# EAGLE board PRN_S2_v1.0 (EAGLE 9.3.0), part 1 of 2
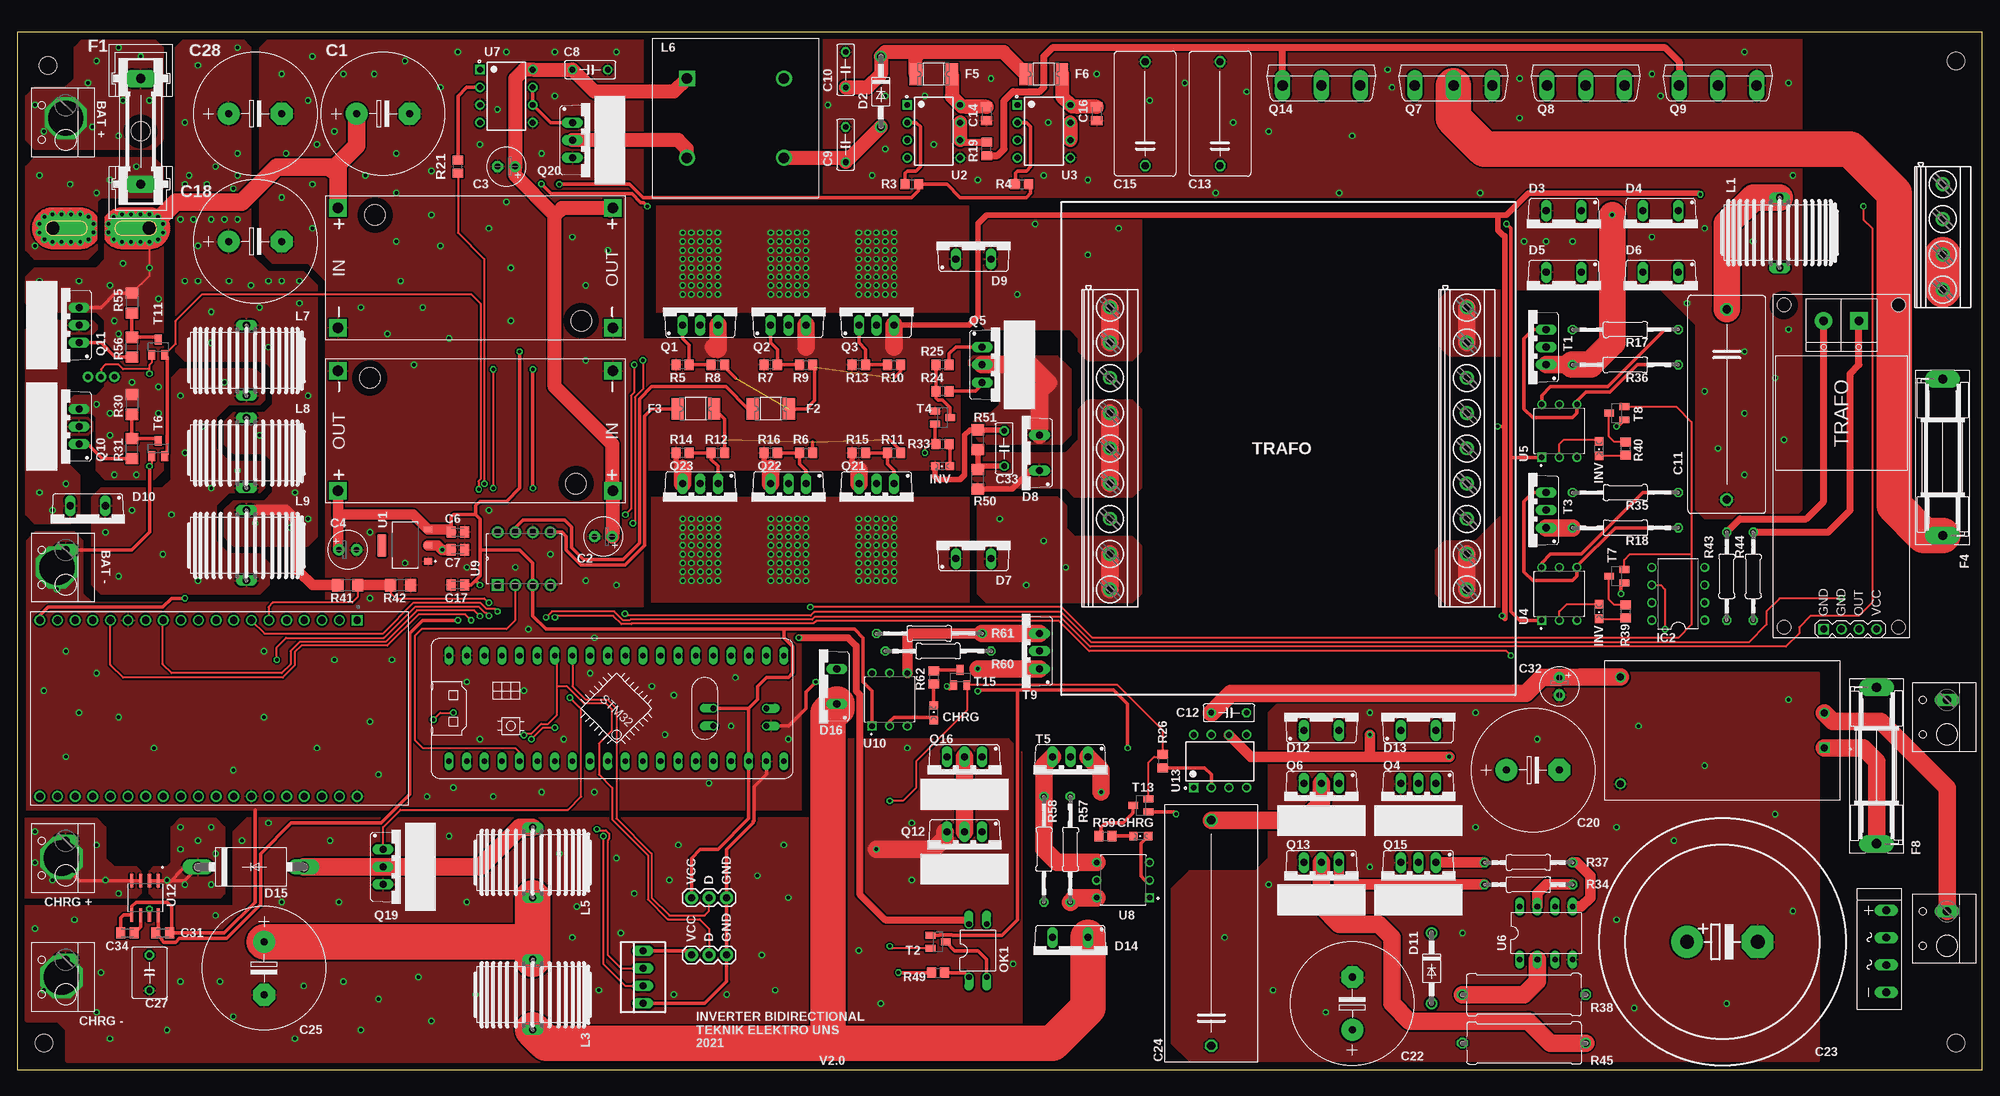
[diagram p2: board, top side]
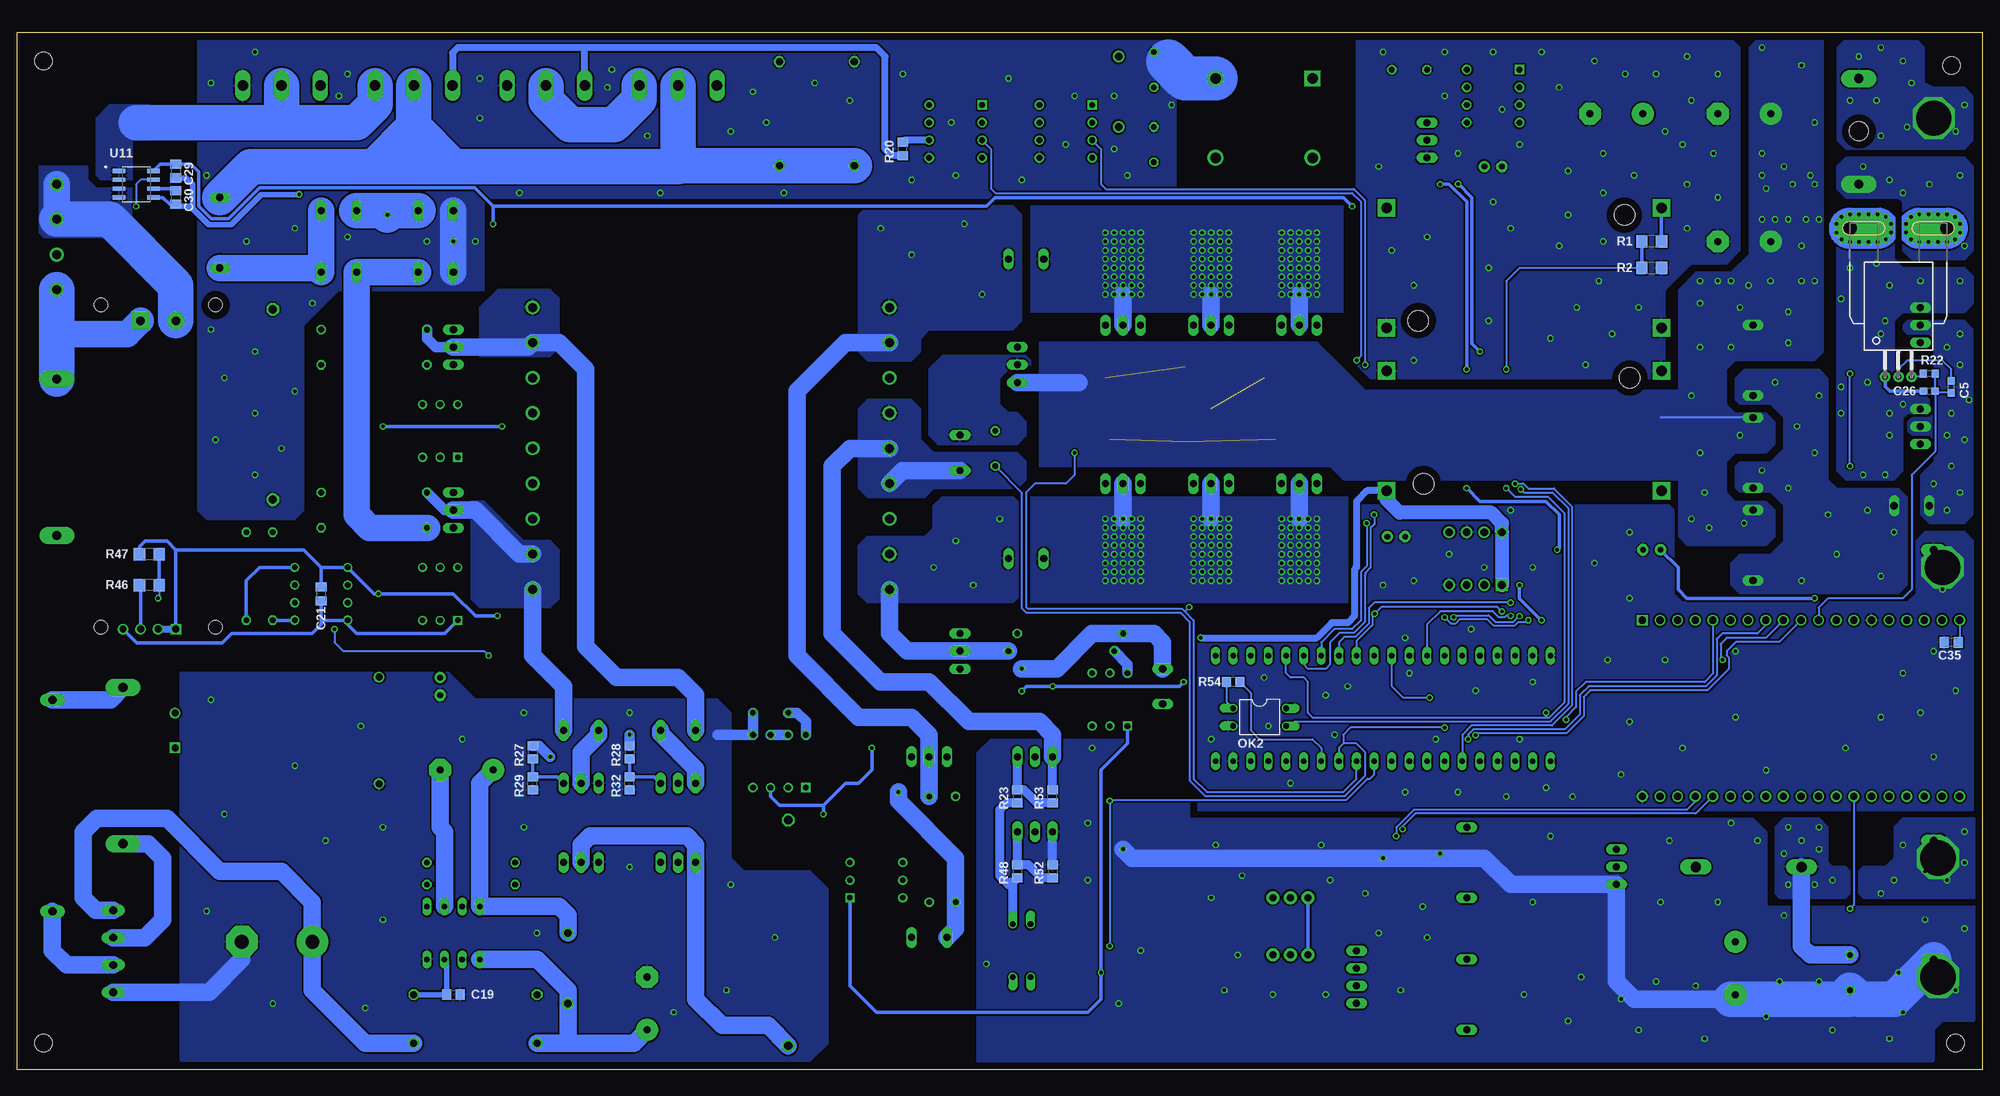
[diagram p3: board, bottom side, seen from below]

Size 283.19 x 149.53 mm. Coordinates in mm from the lower left corner, seen from the top.
Outline: 0,0 283.19,0 283.19,149.53 0,149.53 0,0
Copper layers (1*16): Top 0.035mm / dielectric 1.5mm / Bottom 0.035mm
Design rules "default *": minimum track width 10mil, minimum drill 0.5mm, track to track 10mil, track to pad 10mil, pad to pad 10mil, via to via 10mil, smd to smd 6mil, copper to edge 40mil, drill to drill 6mil, minimum pad ring 10mil, minimum via ring 8mil, stop-mask expansion 4mil, vias tented up to drill 0.6mm, thermal gap 10mil
Holes 2.54 mm at 4.45,144.78 279.4,145.41 279.4,3.81 3.81,3.81

## Footprints (pad centres in the part's own frame; a part is rotated, then mirrored left to right if it is on the bottom)
FBP1,5 = drill 1.118 long: + 5.811,-0.77; - -6,-0.77; AC1 1.874,-0.77; AC2 -2.063,-0.77
E7,5-18 = drill 1.016 pad 3.15: + -3.81,0 | drill 1.016 pad 3.15 octagon: - 3.81,0
E2,5-6 = drill 0.813 pad 1.6: + -1.27,0 | drill 0.813 pad 1.6 octagon: - 1.27,0
C0603 = smd 1.1 x 1: 1 -0.85,0; 2 0.85,0
C0805K = smd 1.3 x 1.6: 1 -1,0; 2 1,0
C050-025X075 = drill 0.813 octagon: 1 -2.54,0; 2 2.54,0
C275-113X316 = drill 1.194 octagon: 1 -13.716,0; 2 13.716,0
C150-091X182 = drill 1.016 octagon: 1 -7.493,0; 2 7.493,0
C0805 = smd 1.3 x 1.5: 1 -0.95,0; 2 0.95,0
EB35D = drill 2.007 pad 4.597: + -5.08,0 | drill 2.007 pad 4.597 octagon: - 5.08,0
C325-137X374 = drill 1.194 octagon: 1 -16.256,0; 2 16.256,0
C050-050X075 = drill 0.813 octagon: 1 -2.54,0; 2 2.54,0
DO41-10 = drill 1.118: A 5.08,0; C -5.08,0
TO220ACS = drill 1.016 long: A 2.54,-2.54; C -2.54,-2.54
DO201-15 = drill 1.499 long: A 7.62,0; C -7.62,0
W237-112 = drill 1.194 long: 1 2.5,-1.27
GSH15 = drill 1.321 pad 2.54 long: 1 -7.62,0; 2 7.62,0 | hole 2.794: 0,0
1812L = smd 1.78 x 3.15: 1 -2.62,0; 2 2.62,0
SH22,5 = drill 1.321 pad 2.54 long: 1 -11.252,0; 2 11.252,0
CB-PFF = drill 0.8 pad 1.5: 1 -1.91,-21.4; 2 0,-21.4; 3 1.91,-21.4 | drill 2 pad 4 offset: IP+ 7,0; IP- -7,0 | drill 0.5 pad 0.9: IP+@2 8.89,0.635; IP+@3 8.89,-0.635; IP+@4 8.175,-1.625; IP+@5 7,-2; IP+@6 5.675,-2; IP+@7 4.35,-2; IP+@8 3,-2; IP+@9 1.825,-1.625; IP+@10 1.1,-0.625; IP+@11 1.1,0.625; IP+@12 1.825,1.625; IP+@13 3,2; IP+@14 4.35,2; IP+@15 5.675,2; IP+@16 7,2; IP+@17 8.175,1.625; IP-@2 -8.89,0.635; IP-@3 -8.89,-0.635; IP-@4 -8.175,-1.625; IP-@5 -7,-2; IP-@6 -5.675,-2; IP-@7 -4.325,-2; IP-@8 -3,-2; IP-@9 -1.825,-1.625; IP-@10 -1.1,-0.625; IP-@11 -1.1,0.625; IP-@12 -1.825,1.625; IP-@13 -3,2; IP-@14 -4.325,2; IP-@15 -5.675,2; IP-@16 -7,2; IP-@17 -8.175,1.625
DIL08 = drill 0.813 pad 1.3: 1 -3.81,-3.81; 2 -1.27,-3.81; 3 1.27,-3.81; 4 3.81,-3.81; 5 3.81,3.81; 6 1.27,3.81; 7 -1.27,3.81; 8 -3.81,3.81
1X03 = drill 1.016 pad 1.88: 1 0,0; 2 2.54,0; 3 5.08,0
SFT830S = drill 1.016 long: 1 -5.08,0; 2 5.08,0
WE-AMT_750082107 = drill 1.52 square: 1 -6.985,5.715 | drill 1.52: 2 -6.985,-5.715; 3 6.985,-5.715; 4 6.985,5.715
CHIPLED_0805 = smd 1.2 x 1.2: A 0,-1.05; C 0,1.05
DIL04 = drill 0.813 offset: 1 -1.27,-3.81; 2 1.27,-3.81; 3 1.27,3.81; 4 -1.27,3.81
CONV_HLK-PM03 = drill 1 square: 1 -14.7,2.5 | drill 1: 2 -14.7,-2.5; 3 14.7,7.7; 4 14.7,-7.7
TO220BV = drill 1.016 long: D 0,-2.54; G -2.54,-2.54; S 2.54,-2.54
TO247BV = drill 1.499 long: D 0,-2.921; G -5.588,-2.921; S 5.588,-2.921
R1206 = smd 1.6 x 1.803: 1 -1.422,0; 2 1.422,0
R0805 = smd 1.3 x 1.5: 1 -0.95,0; 2 0.95,0
0207/15 = drill 0.813 octagon: 1 -7.62,0; 2 7.62,0
R0603 = smd 1 x 1.1: 1 -0.85,0; 2 0.85,0
0207/12 = drill 0.813 octagon: 1 -6.35,0; 2 6.35,0
0617/17 = drill 1.016 octagon: 1 -8.89,0; 2 8.89,0
TO220BV' = drill 1.016 long: G 2.54,-2.54; T1 -2.54,-2.54; T2 0,-2.54
SOT23-EBC = smd 1 x 1.4: B 0.95,-1.1; C 0,1.1; E -0.95,-1.1
SOT229P700X180-4N = smd 0.93 x 1.31: 1 -2.29,-3.345; 2 0,-3.345; 3 2.29,-3.345 | smd 3.24 x 1.31: 4 0,3.345
DIP762W50P254L977H451Q8 = drill 0.85 pad 1.35 square: 1 -3.81,3.81 | drill 0.85 pad 1.35: 2 -3.81,1.27; 3 -3.81,-1.27; 4 -3.81,-3.81; 5 3.81,-3.81; 6 3.81,-1.27; 7 3.81,1.27; 8 3.81,3.81
DIP762W50P254L730H500Q6 = drill 0.8 pad 1.2 square: 1 -3.81,2.54 | drill 0.8 pad 1.2: 2 -3.81,0; 3 -3.81,-2.54; 4 3.81,-2.54; 5 3.81,0; 6 3.81,2.54
DIL08' = drill 0.813 long: 1 -3.81,-3.81; 2 -1.27,-3.81; 3 1.27,-3.81; 4 3.81,-3.81; 5 3.81,3.81; 6 1.27,3.81; 7 -1.27,3.81; 8 -3.81,3.81
DIP254P762X533-8 = drill 1.118 square: 1 -7.62,7.62 | drill 1.118: 2 -7.62,5.08; 3 -7.62,2.54; 4 -7.62,0; 5 0,0; 6 0,2.54; 7 0,5.08; 8 0,7.62
SOIC127P600X175-8N = smd 1.97 x 0.6: 1 -2.475,1.905; 2 -2.475,0.635; 3 -2.475,-0.635; 4 -2.475,-1.905; 5 2.475,-1.905; 6 2.475,-0.635; 7 2.475,0.635; 8 2.475,1.905
MODULE_ESP32-DEVKITC-32D = drill 1.04 square: 1 -12.7,19.76 | drill 1.04: 2 -12.7,17.22; 3 -12.7,14.68; 4 -12.7,12.14; 5 -12.7,9.6; 6 -12.7,7.06; 7 -12.7,4.52; 8 -12.7,1.98; 9 -12.7,-0.56; 10 -12.7,-3.1; 11 -12.7,-5.64; 12 -12.7,-8.18; 13 -12.7,-10.72; 14 -12.7,-13.26; 15 -12.7,-15.8; 16 -12.7,-18.34; 17 -12.7,-20.88; 18 -12.7,-23.42; 19 -12.7,-25.96; 20 12.7,19.76; 21 12.7,17.22; 22 12.7,14.68; 23 12.7,12.14; 24 12.7,9.6; 25 12.7,7.06; 26 12.7,4.52; 27 12.7,1.98; 28 12.7,-0.56; 29 12.7,-3.1; 30 12.7,-5.64; 31 12.7,-8.18; 32 12.7,-10.72; 33 12.7,-13.26; 34 12.7,-15.8; 35 12.7,-18.34; 36 12.7,-20.88; 37 12.7,-23.42; 38 12.7,-25.96
DC-DC-STEP-DOWN-LM2596 = drill 1.5 pad 2.5 square: IN+ -19.812,8.636; IN- -19.812,-8.636; OUT+ 19.812,8.636; OUT- 19.812,-8.636 | hole 3: -14.478,7.62; 15.24,-7.62
BLUE_PILL = drill 0.8 long: P$1 -7.62,15.24; P$2 -7.62,12.7; P$3 -7.62,10.16; P$4 -7.62,7.62; P$5 -7.62,5.08; P$6 -7.62,2.54; P$7 -7.62,0; P$8 -7.62,-2.54; P$9 -7.62,-5.08; P$10 -7.62,-7.62; P$11 -7.62,-10.16; P$12 -7.62,-12.7; P$13 -7.62,-15.24; P$14 -7.62,-17.78; P$15 -7.62,-20.32; P$16 -7.62,-22.86; P$17 -7.62,-25.4; P$18 -7.62,-27.94; P$19 -7.62,-30.48; P$20 -7.62,-33.02; P$21 7.62,15.24; P$22 7.62,12.7; P$23 7.62,10.16; P$24 7.62,7.62; P$25 7.62,5.08; P$26 7.62,2.54; P$27 7.62,0; P$28 7.62,-2.54; P$29 7.62,-5.08; P$30 7.62,-7.62; P$31 7.62,-10.16; P$32 7.62,-12.7; P$33 7.62,-15.24; P$34 7.62,-17.78; P$35 7.62,-20.32; P$36 7.62,-22.86; P$37 7.62,-25.4; P$38 7.62,-27.94; P$39 7.62,-30.48; P$40 7.62,-33.02
AC-VOLTAGE-SENSOR#IC = drill 1 square: 1 23.495,-2.54 | drill 1: 2 23.495,0; 3 23.495,2.54; 4 23.495,5.08 | drill 1.2 pad 2.5 square: P1.1 -20.955,2.54 | drill 1.2 pad 2.5: P1.2 -20.955,-2.54 | hole 2: -23.241,8.255; -23.241,-8.255; 23.241,-8.255; 23.241,8.255
22-23-2041 = drill 1 long: 1 -3.81,0; 2 -1.27,0; 3 1.27,0; 4 3.81,0
MKDSN1,5/9-5,08 = drill 1.3 pad 2: 1 -20.341,0.025; 2 -15.261,0.025; 3 -10.181,0.025; 4 -5.101,0.025; 5 -0.021,0.025; 6 5.059,0.025; 7 10.139,0.025; 8 15.219,0.025; 9 20.299,0.025
MKDSN1,5/4-5,08 = drill 1.3 pad 2: 1 -7.641,0.025; 2 -2.561,0.025; 3 2.519,0.025; 4 7.599,0.025

## Placement (x,y rotation side)
B2  RECTIFIER-FBP1,5  [FBP1,5]  268.61,17.14 90 top
C1  680uF/100V  [E7,5-18]  52.7,137.8 0 top
C2  47uF/50V  [E2,5-6]  84.45,76.84 180 top
C3  47uF/50V  [E2,5-6]  70.48,130.18 180 top
C4  47uF/50V  [E2,5-6]  47.62,74.93 0 top
C5  [C0603]  4.45,98.42 90 bottom
C6  100nF  [C0805K]  63.5,77.47 0 top
C7  100nF  [C0805K]  63.5,74.93 0 top
C8  100nF  [C050-025X075]  82.55,144.14 0 top
C9  100nF  [C050-025X075]  119.38,133.35 90 top
C10  100nF  [C050-025X075]  119.38,144.14 90 top
C11  4.7uF  [C275-113X316]  246.38,95.89 270 top
C12  100nF  [C050-025X075]  174.62,51.44 0 top
C13  1.5uF  [C150-091X182]  173.35,137.8 90 top
C14  100nF  [C0805K]  139.7,137.8 270 top
C15  1.5uF  [C150-091X182]  162.56,137.8 90 top
C16  100nF  [C0805K]  155.57,137.8 270 top
C17  100nF  [C0805K]  63.5,69.85 180 top
C18  470uF/100V  [E7,5-18]  34.29,119.38 0 top
C19  300pf  [C0805]  220.34,10.79 0 bottom
C20  100uF/400V  [E7,5-18]  218.44,43.18 0 top
C21  100nF  [C0805K]  239.39,68.58 90 bottom
C22  100uF/400V  [E7,5-18]  192.41,9.52 90 top
C23  470uF/400V  [EB35D]  245.75,18.41 0 top
C24  [C325-137X374]  172.09,19.68 90 top
C25  47uF  [E7,5-18]  35.56,14.6 270 top
C26  [C0603]  7.62,97.79 0 bottom
C27  47uF  [C050-050X075]  19.05,13.97 270 top
C28  470uF/100V  [E7,5-18]  34.29,137.8 0 top
C29  100nF  [C0805K]  260.35,129.54 270 bottom
C30  1nF  [C0805K]  260.35,125.73 270 bottom
C31  100nF  [C0805K]  20.95,19.68 0 top
C32  47uF/50V  [E2,5-6]  222.25,55.24 270 top
C33  100nF  [C050-025X075]  142.24,89.53 90 top
C34  1nF  [C0805K]  15.87,19.68 180 top
C35  100nF  [C0805K]  4.45,61.59 180 bottom
D2  1N4007  [DO41-10]  124.46,140.97 270 top
D3  MUR860  [TO220ACS]  222.88,121.28 180 top
D4  MUR860  [TO220ACS]  236.85,121.28 180 top
D5  MUR860  [TO220ACS]  222.88,112.39 180 top
D6  MUR860  [TO220ACS]  236.85,112.39 180 top
D7  MUR810  [TO220ACS]  137.79,76.2 0 top
D8  MUR810  [TO220ACS]  144.78,88.9 90 top
D9  MUR810  [TO220ACS]  137.79,119.38 0 top
D10  MUR810  [TO220ACS]  10.16,78.74 180 top
D11  BA159  [DO41-10]  203.84,14.6 270 top
D12  MUR810  [TO220ACS]  187.96,51.44 0 top
D13  MUR810  [TO220ACS]  201.93,51.44 0 top
D14  MUR810  [TO220ACS]  151.76,16.51 180 top
D15  1N5400  [DO201-15]  33.66,29.21 0 top
D16  MUR810  [TO220ACS]  115.57,55.24 90 top
DC_PLN+  [W237-112]  5.71,30.48 90 top
DC_PLN-  [W237-112]  5.71,13.33 90 top
F1  50A  [GSH15]  17.78,135.25 270 top
F2  1812L010  [1812L]  108.58,95.25 180 top
F3  1812L010  [1812L]  97.79,95.25 180 top
F4  FUSESH22,5  [SH22,5]  277.5,88.27 90 top
F5  1812L010  [1812L]  132.08,143.51 180 top
F6  1812L010  [1812L]  147.95,143.51 180 top
F8  FUSE 0,5A  [SH22,5]  267.97,43.81 90 top
IC1  ACS758ECB-200B-PFF-T  [CB-PFF]  12.06,121.28 0 bottom
IC2  HCPL-3700  [DIL08]  239.39,68.58 90 top
J1  LM35  [1X03]  102.23,24.77 180 top
J2  LM35  [1X03]  102.23,16.51 180 top
L1  SFT830S  [SFT830S]  254,120.65 90 top
L3  SFT830S  [SFT830S]  74.29,10.79 90 top
L5  220uH  [SFT830S]  74.29,29.84 90 top
L6  [WE-AMT_750082107]  103.5,137.16 0 top
L7  4mH  [SFT830S]  33.02,102.23 90 top
L8  4mH  [SFT830S]  33.02,88.9 90 top
L9  4mH  [SFT830S]  33.02,75.56 90 top
LED3  [CHIPLED_0805]  133.35,87 90 top
LED5  [CHIPLED_0805]  227.97,66.04 180 top
LED6  [CHIPLED_0805]  227.97,89.53 180 top
LED9  [CHIPLED_0805]  161.92,33.66 90 top
LED10  [CHIPLED_0805]  132.08,51.44 0 top
OK1  PC817  [DIL04]  138.43,17.14 0 top
OK2  PC817  [DIL04]  104.14,50.8 270 bottom
PS1  HLK-PM12  [CONV_HLK-PM03]  245.75,48.89 180 top
Q1  FB4332  [TO220BV]  98.42,109.86 0 top
Q2  FB4332  [TO220BV]  111.12,109.86 0 top
Q3  FB4332  [TO220BV]  123.82,109.86 0 top
Q4  FB4332  [TO220BV]  201.93,38.73 180 top
Q5  IRF4905  [TO220BV]  141.6,101.6 270 top
Q6  FB4332  [TO220BV]  187.96,38.73 180 top
Q7  IRFP240  [TO247BV]  207.01,144.78 0 top
Q8  IRFP240  [TO247BV]  226.06,144.78 0 top
Q9  IRFP240  [TO247BV]  245.11,144.78 0 top
Q10  FQP47P06  [TO220BV]  6.35,92.71 90 top
Q11  FQP47P06  [TO220BV]  6.35,107.31 90 top
Q12  FB4332  [TO220BV]  136.53,31.75 180 top
Q13  FB4332  [TO220BV]  187.96,27.3 180 top
Q14  IRFP240  [TO247BV]  187.96,144.78 0 top
Q15  FB4332  [TO220BV]  201.93,27.3 180 top
Q16  FB4332  [TO220BV]  136.53,42.55 180 top
Q19  NMOSFET  [TO220BV]  55.24,29.21 270 top
Q20  IRFB4229  [TO220BV]  82.55,133.99 270 top
Q21  FB4332  [TO220BV]  123.82,81.91 180 top
Q22  FB4332  [TO220BV]  111.12,81.91 180 top
Q23  FB4332  [TO220BV]  98.42,81.91 180 top
R1  200k 1206  [R1206]  47.62,119.38 0 bottom
R2  10k 1206  [R1206]  47.62,115.57 180 bottom
R3  100R  [R0805]  128.91,127.64 0 top
R4  100R  [R0805]  144.78,127.64 0 top
R5  100k  [R0805]  95.88,101.6 180 top
R6  1k  [R0805]  113.66,88.9 0 top
R7  100k  [R0805]  108.58,101.6 180 top
R8  1k  [R0805]  100.96,101.6 0 top
R9  1k  [R0805]  113.66,101.6 0 top
R10  1k  [R0805]  126.36,101.6 0 top
R11  1k  [R0805]  126.36,88.9 0 top
R12  1k  [R0805]  100.96,88.9 0 top
R13  100k  [R0805]  121.28,101.6 180 top
R14  100k  [R0805]  95.88,88.9 180 top
R15  100k  [R0805]  121.28,88.9 180 top
R16  100k  [R0805]  108.58,88.9 180 top
R17  300R  [0207/15]  231.78,106.68 0 top
R18  150R  [0207/15]  231.78,78.1 180 top
R19  100R  [R0805]  139.7,132.72 90 top
R20  100R  [R0805]  155.57,132.72 90 bottom
R21  100R  [R0805]  63.5,130.18 90 top
R22  [R0603]  7.62,100.33 0 bottom
R23  1k  [R0805]  139.06,39.37 270 bottom
R24  100k  [R0805]  133.35,97.79 180 top
R25  1k  [R0805]  133.35,101.6 180 top
R26  100R  [R0805]  165.1,44.45 270 top
R27  1k  [R0805]  208.91,45.72 270 bottom
R28  1k  [R0805]  194.94,45.72 270 bottom
R29  100k  [R0805]  208.91,41.27 90 bottom
R30  100k 1206  [R1206]  16.51,95.89 90 top
R31  1k 1206  [R1206]  16.51,89.53 270 top
R32  100k  [R0805]  194.94,41.27 90 bottom
R33  220R  [R0805]  133.35,90.17 0 top
R34  1k  [0207/12]  217.81,26.67 0 top
R35  300R  [0207/15]  231.78,83.19 180 top
R36  150R  [0207/15]  231.78,101.6 0 top
R37  1k  [0207/12]  217.81,29.84 0 top
R38  47k  [0617/17]  217.17,10.79 0 top
R39  220R  [R0805]  231.78,66.04 270 top
R40  220R  [R0805]  231.78,89.53 270 top
R41  200k 1206  [R1206]  47.62,69.85 180 top
R42  10k 1206  [R1206]  55.24,69.85 180 top
R43  10k  [0207/12]  246.38,71.12 270 top
R44  10k  [0207/12]  250.19,71.12 270 top
R45  4k7  [0617/17]  217.17,3.81 180 top
R46  1k  [R1206]  264.16,69.85 0 bottom
R47  1k  [R1206]  264.16,74.3 0 bottom
R48  1k  [R0805]  139.06,28.57 270 bottom
R49  220R  [R0805]  132.72,13.97 0 top
R50  200k 1206  [R1206]  138.43,85.09 270 top
R51  10k 1206  [R1206]  138.43,90.81 270 top
R52  1k  [R0805]  133.98,28.57 270 bottom
R53  1k  [R0805]  133.98,39.37 90 bottom
R54  220R  [R0805]  107.95,55.88 180 bottom
R55  100k 1206  [R1206]  16.51,110.49 90 top
R56  1k 1206  [R1206]  16.51,104.14 270 top
R57  300R  [0207/15]  151.76,31.75 270 top
R58  150R  [0207/15]  147.95,31.75 90 top
R59  220R  [R0805]  156.84,33.66 0 top
R60  300R  [0207/15]  132.72,60.33 180 top
R61  150R  [0207/15]  131.44,62.87 0 top
R62  220R  [R0805]  132.08,56.52 270 top
T1  BT136-V  [TO220BV']  217.81,104.14 90 top
T2  MBBT222  [SOT23-EBC]  132.72,18.41 270 top
T3  BT136-V  [TO220BV']  217.81,80.64 90 top
T4  MBBT222  [SOT23-EBC]  133.35,93.98 270 top
T5  BT136-V  [TO220BV']  151.76,42.55 180 top
T6  MBBT222  [SOT23-EBC]  20.32,89.53 0 top
T7  MBBT222  [SOT23-EBC]  230.5,71.12 90 top
T8  MBBT222  [SOT23-EBC]  230.5,94.61 90 top
T9  BT136-V  [TO220BV']  144.78,60.33 90 top
T11  MBBT222  [SOT23-EBC]  20.32,104.14 0 top
T13  MBBT222  [SOT23-EBC]  161.92,38.1 90 top
T15  MBBT222  [SOT23-EBC]  135.89,56.52 0 top
U1  AMS1117-3.3  [SOT229P700X180-4N]  55.88,75.56 90 top
U2  VO3120  [DIP762W50P254L977H451Q8]  132.08,135.25 0 top
U3  VO3120  [DIP762W50P254L977H451Q8]  147.95,135.25 0 top
U4  MOC3063S  [DIP762W50P254L730H500Q6]  222.25,68.58 90 top
U5  MOC3063S  [DIP762W50P254L730H500Q6]  222.25,92.07 90 top
U6  IR2153  [DIL08']  220.34,19.68 0 top
U7  VO3120  [DIP762W50P254L977H451Q8]  70.48,140.33 0 top
U8  MOC3063S  [DIP762W50P254L730H500Q6]  159.38,27.3 180 top
U9  IR2104  [DIP254P762X533-8]  76.83,77.47 90 top
U10  MOC3063S  [DIP762W50P254L730H500Q6]  125.73,53.34 90 top
U11  ACS712ELCTR15AT  [SOIC127P600X175-8N]  266.06,127.64 0 bottom
U12  ACS712ELCTR15AT  [SOIC127P600X175-8N]  18.41,24.77 270 top
U13  VO3120  [DIP762W50P254L977H451Q8]  173.35,44.45 90 top
U14  ESP32-DEVKITC-32D  [MODULE_ESP32-DEVKITC-32D]  29.21,52.07 270 top
U$1  DC-DC-STEP-DOWN-LM2596  [DC-DC-STEP-DOWN-LM2596]  66.04,115.57 0 top
U$2  DC-DC-STEP-DOWN-LM2596  [DC-DC-STEP-DOWN-LM2596]  66.04,92.07 180 top
U$3  [BLUE_PILL]  77.47,52.07 90 top
U$4  AC-VOLTAGE-SENSOR#IC  [AC-VOLTAGE-SENSOR#IC]  262.89,87 270 top
X1  nextion_lcd  [22-23-2041]  90.17,13.33 90 top
X2  MKDSN1,5/9-5,08  [MKDSN1,5/9-5,08]  157.48,89.53 270 top
X3  [W237-112]  5.71,136.53 90 top
X4  [W237-112]  5.71,72.39 90 top
X5  MKDSN1,5/9-5,08  [MKDSN1,5/9-5,08]  208.91,89.53 270 top
X6  MKDSN1,5/4-5,08  [MKDSN1,5/4-5,08]  277.5,120.02 270 top
X8  [W237-112]  276.86,50.8 90 top
X12  [W237-112]  276.86,20.32 90 top